# EasyEDA Pro project ProProject_2024电赛备赛清单_Wang01_2024-08-05.epro, schematic Schematic4
Create Date: 2024-07-20; Page Name: P1; Project Name: 2024电赛备赛清单_Wang01; Schematic Name: Schematic4; Update Date: 2024-07-20; Company: 嘉立创EDA; Page Size: A4; Version: V1.0
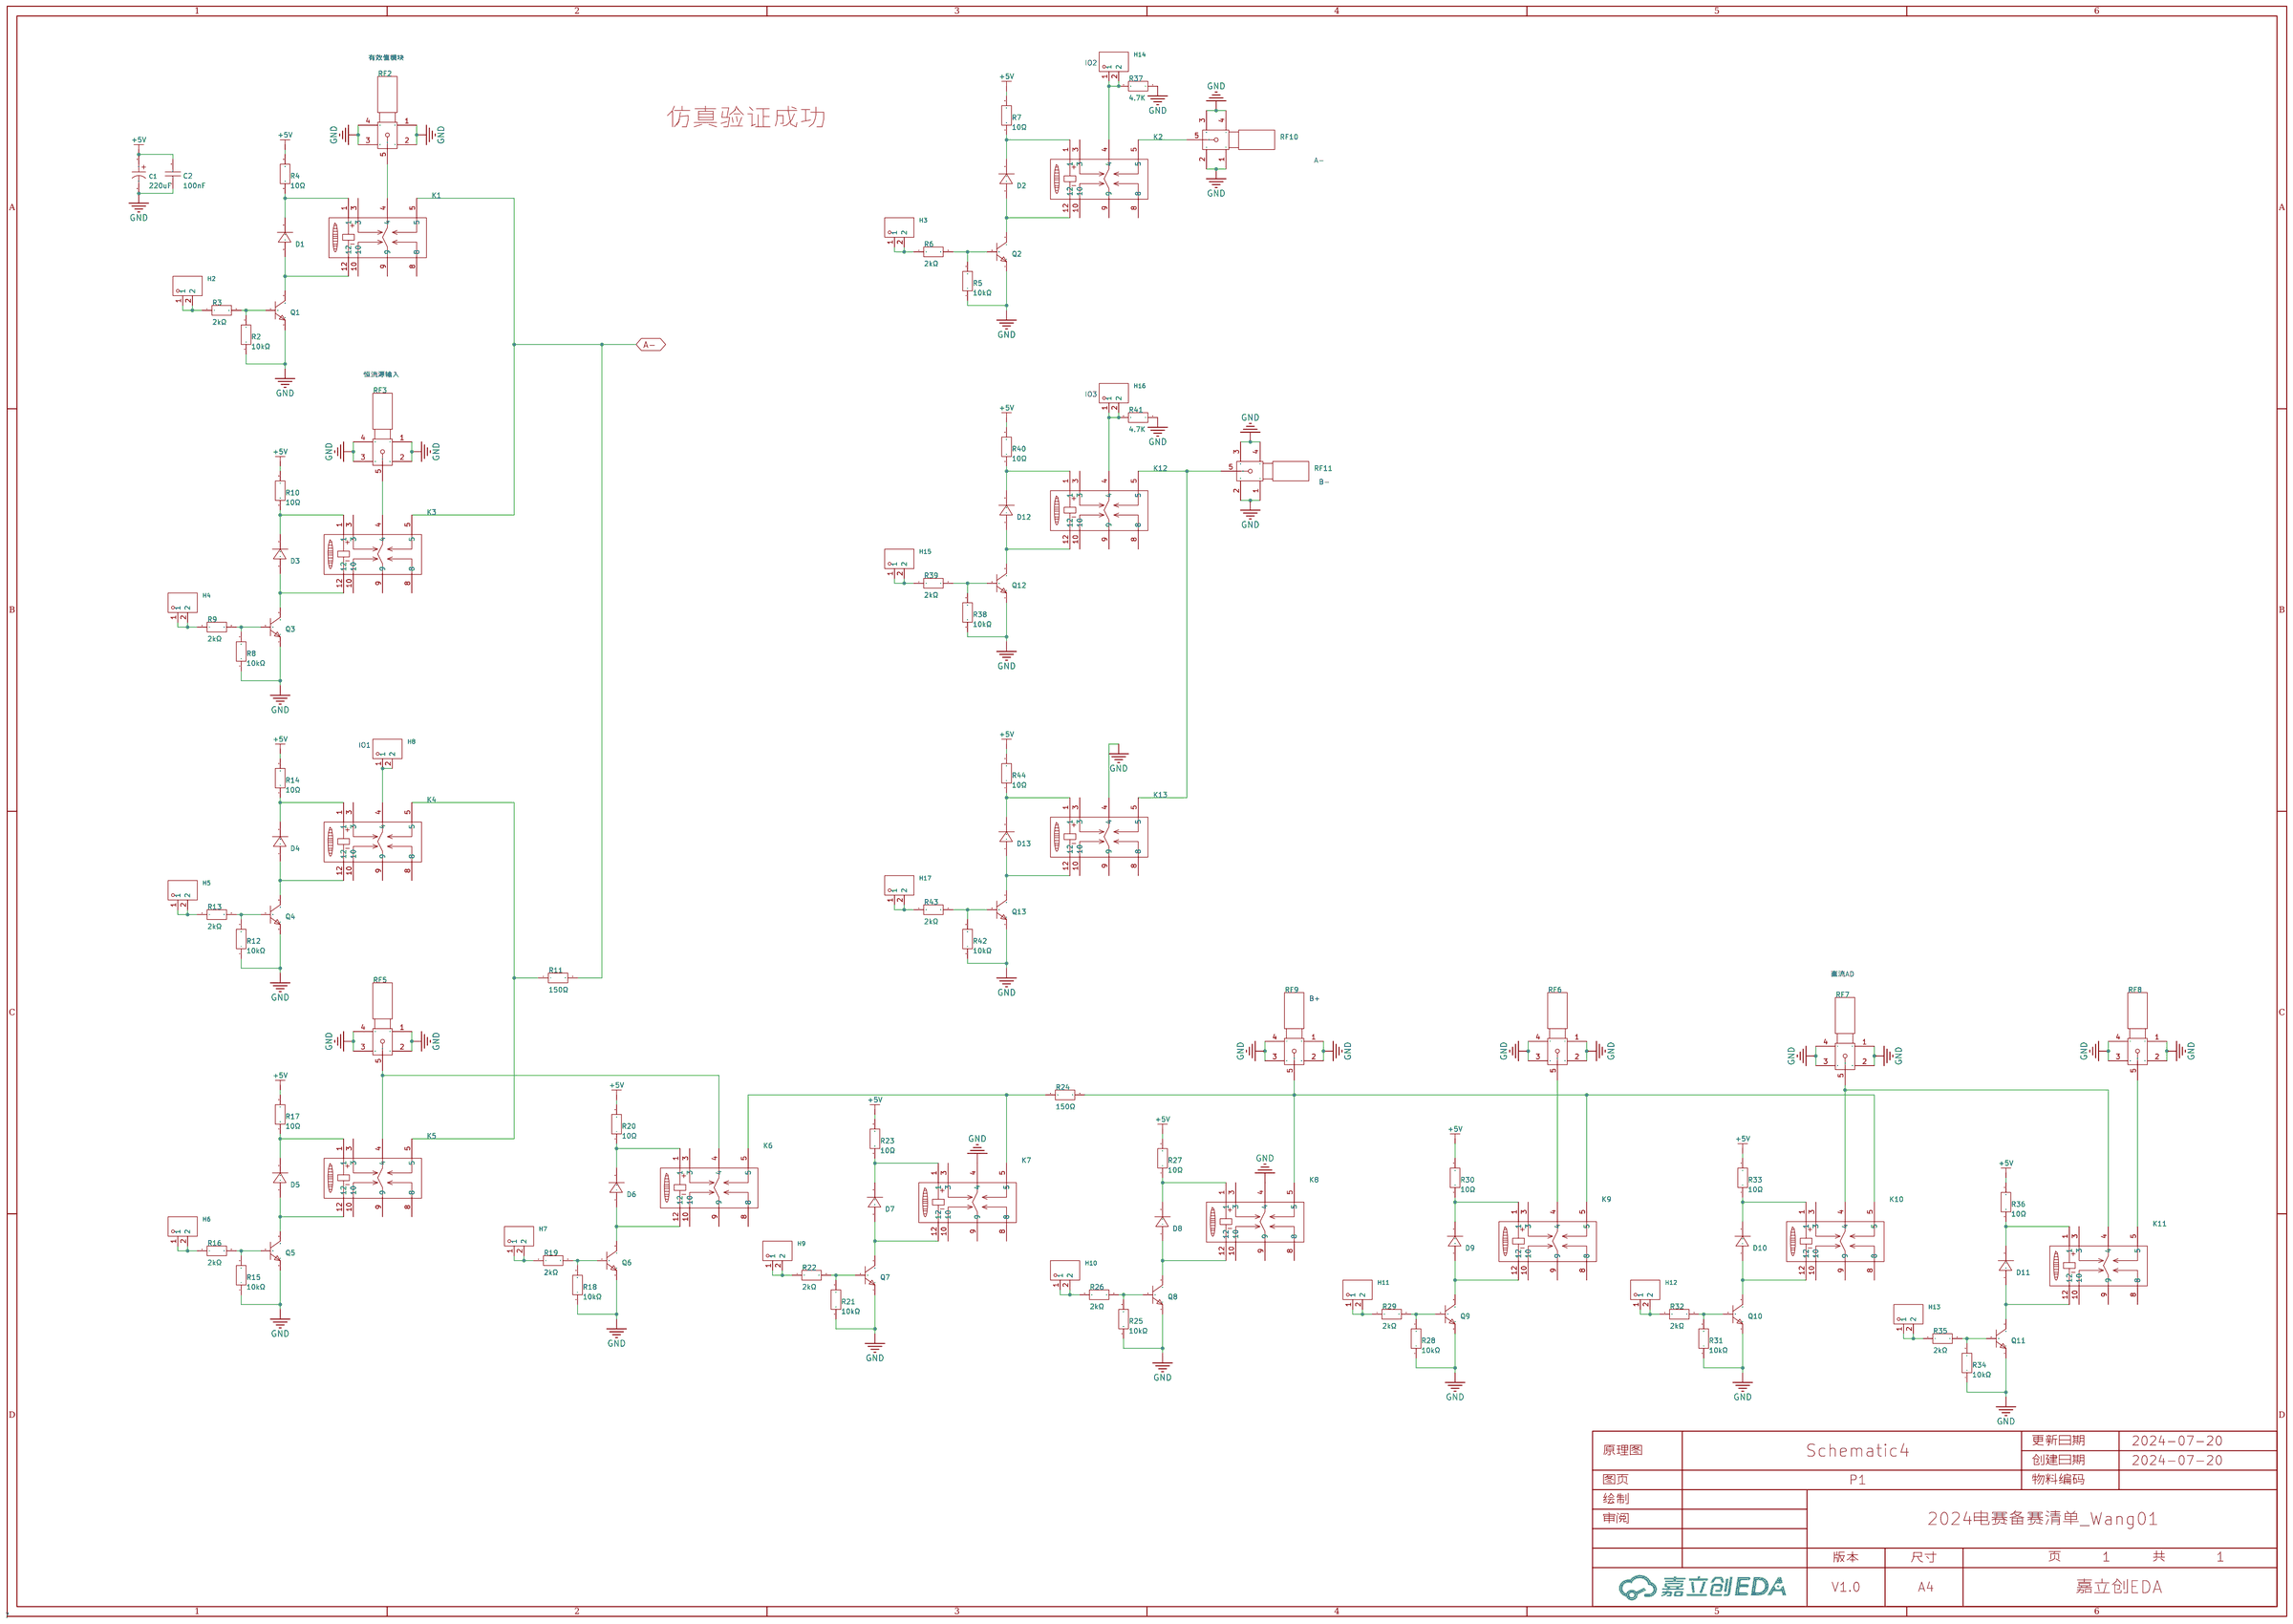
[diagram p3: schematic sheet]

## Parts
C1  220uF  [CAP-SMD_BD6.3-L6.6-W6.6-FD]
C2  100nF  [C0603]
D1  1N4148  [DO-35_BD2.0-L4.0-P8.00-D0.5-FD]
D2  1N4148  [DO-35_BD2.0-L4.0-P8.00-D0.5-FD]
D3  1N4148  [DO-35_BD2.0-L4.0-P8.00-D0.5-FD]
D4  1N4148  [DO-35_BD2.0-L4.0-P8.00-D0.5-FD]
D5  1N4148  [DO-35_BD2.0-L4.0-P8.00-D0.5-FD]
D6  1N4148  [DO-35_BD2.0-L4.0-P8.00-D0.5-FD]
D7  1N4148  [DO-35_BD2.0-L4.0-P8.00-D0.5-FD]
D8  1N4148  [DO-35_BD2.0-L4.0-P8.00-D0.5-FD]
D9  1N4148  [DO-35_BD2.0-L4.0-P8.00-D0.5-FD]
D10  1N4148  [DO-35_BD2.0-L4.0-P8.00-D0.5-FD]
D11  1N4148  [DO-35_BD2.0-L4.0-P8.00-D0.5-FD]
D12  1N4148  [DO-35_BD2.0-L4.0-P8.00-D0.5-FD]
D13  1N4148  [DO-35_BD2.0-L4.0-P8.00-D0.5-FD]
H2  PZ254V-11-02P  [HDR-TH_2P-P2.54-V-M]
H3  PZ254V-11-02P  [HDR-TH_2P-P2.54-V-M]
H4  PZ254V-11-02P  [HDR-TH_2P-P2.54-V-M]
H5  PZ254V-11-02P  [HDR-TH_2P-P2.54-V-M]
H6  PZ254V-11-02P  [HDR-TH_2P-P2.54-V-M]
H7  PZ254V-11-02P  [HDR-TH_2P-P2.54-V-M]
H8  PZ254V-11-02P  [HDR-TH_2P-P2.54-V-M]
H9  PZ254V-11-02P  [HDR-TH_2P-P2.54-V-M]
H10  PZ254V-11-02P  [HDR-TH_2P-P2.54-V-M]
H11  PZ254V-11-02P  [HDR-TH_2P-P2.54-V-M]
H12  PZ254V-11-02P  [HDR-TH_2P-P2.54-V-M]
H13  PZ254V-11-02P  [HDR-TH_2P-P2.54-V-M]
H14  PZ254V-11-02P  [HDR-TH_2P-P2.54-V-M]
H15  PZ254V-11-02P  [HDR-TH_2P-P2.54-V-M]
H16  PZ254V-11-02P  [HDR-TH_2P-P2.54-V-M]
H17  PZ254V-11-02P  [HDR-TH_2P-P2.54-V-M]
K1  G6S-2 DC5  [RELAY-TH_G6S-2-X]
K2  G6S-2 DC5  [RELAY-TH_G6S-2-X]
K3  G6S-2 DC5  [RELAY-TH_G6S-2-X]
K4  G6S-2 DC5  [RELAY-TH_G6S-2-X]
K5  G6S-2 DC5  [RELAY-TH_G6S-2-X]
K6  G6S-2 DC5  [RELAY-TH_G6S-2-X]
K7  G6S-2 DC5  [RELAY-TH_G6S-2-X]
K8  G6S-2 DC5  [RELAY-TH_G6S-2-X]
K9  G6S-2 DC5  [RELAY-TH_G6S-2-X]
K10  G6S-2 DC5  [RELAY-TH_G6S-2-X]
K11  G6S-2 DC5  [RELAY-TH_G6S-2-X]
K12  G6S-2 DC5  [RELAY-TH_G6S-2-X]
K13  G6S-2 DC5  [RELAY-TH_G6S-2-X]
Q1  SS8050  [TO-92-3_L4.9-W3.7-P1.27-L]
Q2  SS8050  [TO-92-3_L4.9-W3.7-P1.27-L]
Q3  SS8050  [TO-92-3_L4.9-W3.7-P1.27-L]
Q4  SS8050  [TO-92-3_L4.9-W3.7-P1.27-L]
Q5  SS8050  [TO-92-3_L4.9-W3.7-P1.27-L]
Q6  SS8050  [TO-92-3_L4.9-W3.7-P1.27-L]
Q7  SS8050  [TO-92-3_L4.9-W3.7-P1.27-L]
Q8  SS8050  [TO-92-3_L4.9-W3.7-P1.27-L]
Q9  SS8050  [TO-92-3_L4.9-W3.7-P1.27-L]
Q10  SS8050  [TO-92-3_L4.9-W3.7-P1.27-L]
Q11  SS8050  [TO-92-3_L4.9-W3.7-P1.27-L]
Q12  SS8050  [TO-92-3_L4.9-W3.7-P1.27-L]
Q13  SS8050  [TO-92-3_L4.9-W3.7-P1.27-L]
R2  10kΩ  [RES-TH_BD2.4-L6.3-P10.30-D0.6]
R3  2kΩ  [RES-TH_BD2.4-L6.3-P10.30-D0.6]
R4  10Ω  [RES-TH_BD2.4-L6.3-P10.30-D0.6]
R5  10kΩ  [RES-TH_BD2.4-L6.3-P10.30-D0.6]
R6  2kΩ  [RES-TH_BD2.4-L6.3-P10.30-D0.6]
R7  10Ω  [RES-TH_BD2.4-L6.3-P10.30-D0.6]
R8  10kΩ  [RES-TH_BD2.4-L6.3-P10.30-D0.6]
R9  2kΩ  [RES-TH_BD2.4-L6.3-P10.30-D0.6]
R10  10Ω  [RES-TH_BD2.4-L6.3-P10.30-D0.6]
R11  150Ω  [RES-TH_BD2.4-L6.3-P10.30-D0.6]
R12  10kΩ  [RES-TH_BD2.4-L6.3-P10.30-D0.6]
R13  2kΩ  [RES-TH_BD2.4-L6.3-P10.30-D0.6]
R14  10Ω  [RES-TH_BD2.4-L6.3-P10.30-D0.6]
R15  10kΩ  [RES-TH_BD2.4-L6.3-P10.30-D0.6]
R16  2kΩ  [RES-TH_BD2.4-L6.3-P10.30-D0.6]
R17  10Ω  [RES-TH_BD2.4-L6.3-P10.30-D0.6]
R18  10kΩ  [RES-TH_BD2.4-L6.3-P10.30-D0.6]
R19  2kΩ  [RES-TH_BD2.4-L6.3-P10.30-D0.6]
R20  10Ω  [RES-TH_BD2.4-L6.3-P10.30-D0.6]
R21  10kΩ  [RES-TH_BD2.4-L6.3-P10.30-D0.6]
R22  2kΩ  [RES-TH_BD2.4-L6.3-P10.30-D0.6]
R23  10Ω  [RES-TH_BD2.4-L6.3-P10.30-D0.6]
R24  150Ω  [RES-TH_BD2.4-L6.3-P10.30-D0.6]
R25  10kΩ  [RES-TH_BD2.4-L6.3-P10.30-D0.6]
R26  2kΩ  [RES-TH_BD2.4-L6.3-P10.30-D0.6]
R27  10Ω  [RES-TH_BD2.4-L6.3-P10.30-D0.6]
R28  10kΩ  [RES-TH_BD2.4-L6.3-P10.30-D0.6]
R29  2kΩ  [RES-TH_BD2.4-L6.3-P10.30-D0.6]
R30  10Ω  [RES-TH_BD2.4-L6.3-P10.30-D0.6]
R31  10kΩ  [RES-TH_BD2.4-L6.3-P10.30-D0.6]
R32  2kΩ  [RES-TH_BD2.4-L6.3-P10.30-D0.6]
R33  10Ω  [RES-TH_BD2.4-L6.3-P10.30-D0.6]
R34  10kΩ  [RES-TH_BD2.4-L6.3-P10.30-D0.6]
R35  2kΩ  [RES-TH_BD2.4-L6.3-P10.30-D0.6]
R36  10Ω  [RES-TH_BD2.4-L6.3-P10.30-D0.6]
R37  4.7K  [RES-TH_BD2.4-L6.3-P10.30-D0.6]
R38  10kΩ  [RES-TH_BD2.4-L6.3-P10.30-D0.6]
R39  2kΩ  [RES-TH_BD2.4-L6.3-P10.30-D0.6]
R40  10Ω  [RES-TH_BD2.4-L6.3-P10.30-D0.6]
R41  4.7K  [RES-TH_BD2.4-L6.3-P10.30-D0.6]
R42  10kΩ  [RES-TH_BD2.4-L6.3-P10.30-D0.6]
R43  2kΩ  [RES-TH_BD2.4-L6.3-P10.30-D0.6]
R44  10Ω  [RES-TH_BD2.4-L6.3-P10.30-D0.6]
RF2  BWSMA-KE-Z001  [SMA-TH_BWSMA-KE-Z001]
RF3  BWSMA-KE-Z001  [SMA-TH_BWSMA-KE-Z001]
RF5  BWSMA-KE-Z001  [SMA-TH_BWSMA-KE-Z001]
RF6  BWSMA-KE-Z001  [SMA-TH_BWSMA-KE-Z001]
RF7  BWSMA-KE-Z001  [SMA-TH_BWSMA-KE-Z001]
RF8  BWSMA-KE-Z001  [SMA-TH_BWSMA-KE-Z001]
RF9  BWSMA-KE-Z001  [SMA-TH_BWSMA-KE-Z001]
RF10  BWSMA-KE-Z001  [SMA-TH_BWSMA-KE-Z001]
RF11  BWSMA-KE-Z001  [SMA-TH_BWSMA-KE-Z001]

## Library data of the parts
C1 = RVT220UF16V67RV0015: 容值:220uF;精度:±20%;额定电压:16V;纹波电流:110mA@120Hz;等效串联电阻:-;; LCSC Part Name: 220uF ±20% 16V; Supplier Part: C2887273; Manufacturer: KNSCHA(科尼盛); Supplier Footprint: SMD,D6.3xL7.7mm; Datasheet: https://atta.szlcsc.com/upload/public/pdf/source/20210824/3DC9999D9B098FE241E3A26137981C4C.pdf; Supplier: LCSC; Tolerance: ±20%; Rated Voltage: 16V; φD: 6.3mm; L: 7.7mm; Ripple Current: 110mA@120Hz; Lifetime @ Temp: 2000hrs@105℃; Operating Temperature: -55℃~+105℃
C2 = 0603B104K500NT: 容值:100nF;精度:±10%;额定电压:50V;材质(温度系数):X7R;; LCSC Part Name: 100nF ±10% 50V; Supplier Part: C30926; Manufacturer: FH(风华); Supplier Footprint: 0603; Datasheet: https://atta.szlcsc.com/upload/public/pdf/source/20170923/C30926_1506149436298988724.pdf; Supplier: LCSC; Tolerance: ±10%; Voltage Rated: 50V; Temperature Coefficient: X7R
D1-D13 = 1N4148_C14516: 二极管配置:-;功率:500mW;直流反向耐压(Vr):75V;平均整流电流(Io):200mA;正向压降(Vf):1V@10mA;反向电流(Ir):5uA@75V;反向恢复时间(trr):4ns;工作温度:+200℃@(Tj);; LCSC Part Name: 75V 200mA 4ns; Supplier Part: C14516; Manufacturer: ST(先科); Supplier Footprint: DO-35; Datasheet: https://atta.szlcsc.com/upload/public/pdf/source/20140303/1457707004955.pdf; Supplier: LCSC; Power Dissipation: 500mW; Reverse Voltage (Vr): 75V; Average Rectified Current (Io): 200mA; Forward Voltage (Vf@If): 1V@10mA; Reverse Leakage Current: 5uA@75V; Reverse Recovery Time (trr): 4ns; Operating Temperature: +200℃@(Tj)
H2-H17 = PZ254V-11-02P: 排数:单排;总PIN位数:2P;间距:2.54mm;插针结构:1x2P;行距:-;安装类型:直插;圆针/方针:方针;额定电流:-;额定电压:-;配合针长度:6mm;塑高:2.5mm;端接针长度:3mm;触头材质:黄铜;触头镀层:-;工作温度范围:-40℃~+105℃;颜色:黑色;; LCSC Part Name: 2.54mm 1x2P 直插 方针; Supplier Part: C492401; Manufacturer: XFCN(兴飞); Supplier Footprint: 插件,P=2.54mm; Datasheet: https://atta.szlcsc.com/upload/public/pdf/source/20200309/C492401_A812433581A9B211A7FFA413ADDFF0E5.pdf; Supplier: LCSC; Number of Rows: 单排; Number of Pins: 2P; Pitch: 2.54mm; Pin Structure: 1x2P; Mounting Type: 直插; Circluar Pins/Square Pins: 方针; Length of Mating Pin: 6mm; Insulation Height: 2.5mm; Length of End Connection Pin: 3mm; Contact Material: 黄铜; Operating Temperature Range: -40℃~+105℃; Color: 黑色
K1-K13 = G6S-2 DC5: 线圈电压:-;触点形式:-;最大切换电压:-;最大切换电流:-;线圈类型:-;触点材料:-;; LCSC Part Name: G6S-2-5V; Supplier Part: C32776; Manufacturer: OMRON(欧姆龙); Supplier Footprint: DIP-8; JLCPCB Part Class: 扩展库; Datasheet: https://atta.szlcsc.com/upload/public/pdf/source/20180910/C231396_388937E7606AF1B60CB333B596E64AED.pdf; Supplier: LCSC
Q1-Q13 = SS8050_C12840: 晶体管类型:NPN;集射极击穿电压(Vceo):25V;集电极电流(Ic):1.5A;功率(Pd):1W;集电极截止电流(Icbo):100nA;集电极-发射极饱和电压(VCE(sat)@Ic,Ib):500mV@800mA,80mA;直流电流增益(hFE@Ic,Vce):200@100mA,1V;特征频率(fT):100MHz;工作温度:+150℃@(Tj);; LCSC Part Name: NPN 25V 1.5A D档 200-300; Supplier Part: C12840; Manufacturer: CJ(江苏长电/长晶); Supplier Footprint: TO-92(TO-92-3); Datasheet: https://atta.szlcsc.com/upload/public/pdf/source/20140809/1457707204665.pdf; Supplier: LCSC; Transistor Type: NPN; Collector-Emitter Breakdown Voltage (Vceo): 25V; Collector Current (Ic): 1.5A; Power Dissipation (Pd): 1W; Collector Cut-Off Current (Icbo): 100nA; Collector-Emitter Saturation Voltage (VCE(sat)@Ic,Ib): 500mV@800mA,80mA; DC Current Gain (hFE@Ic,Vce): 200@100mA,1V; Transition Frequency (fT): 100MHz; Operating Temperature: +150℃@(Tj)
R2-R44 = RN1/4W10KFT/BA1: 电阻类型:金属膜电阻;阻值:10kΩ;精度:±1%;功率:250mW;温度系数:±50ppm/℃;最大工作电压:250V;工作温度范围:-55℃~+125℃;; LCSC Part Name: 金属膜电阻 10kΩ ±1% 250mW; Supplier Part: C410695; Manufacturer: Tyohm(幸亚电阻); Supplier Footprint: 插件; Datasheet: https://atta.szlcsc.com/upload/public/pdf/source/20190808/C410695_F4C96186075092C4BC649A77CE7E5B2A.pdf; Supplier: LCSC; Type: 金属膜电阻; Tolerance: ±1%; Power(Watts): 250mW; Temperature Coefficient: ±50ppm/℃; Overload Voltage (Max): 250V; Operating Temperature Range: -55℃~+125℃
RF2 RF3 RF5-RF11 = BWSMA-KE-Z001_C496549: 连接器类型:板端;射频系列:SMA;接口类型:内孔;端口数量:1;阻抗:50Ω;频率-最大值:12.4GHz;样式:正脚;接口直径:-;接口长度/高度:-;工作温度范围:-65℃~+165℃;; LCSC Part Name: SMA 内孔 正脚 SMA直头正脚板端座子; Supplier Part: C496549; Manufacturer: BAT WIRELESS(蝙蝠无线); Supplier Footprint: 插件; Datasheet: https://atta.szlcsc.com/upload/public/pdf/source/20200416/C496549_767995352B6C9E98F20D658FDC70347F.pdf; Supplier: LCSC; Connector Type: 板端; RF Series: SMA; Interface Type: 内孔; Number of Ports: 1; Impedance: 50Ω; Frequency-Max: 12.4GHz; Style: 正脚; Operating Temperature Range: -65℃~+165℃

## Nets
+5V: C1.1 C2.2 R4.2 R7.2 R10.2 R14.2 R17.2 R20.2 R23.2 R27.2 R30.2 R33.2 R36.2 R40.2 R44.2
GND: C1.2 C2.1 K7.4 K8.4 K13.4 Q1.1(E) Q2.1(E) Q3.1(E) Q4.1(E) Q5.1(E) Q6.1(E) Q7.1(E) Q8.1(E) Q9.1(E) Q10.1(E) Q11.1(E) Q12.1(E) Q13.1(E) R2.1 R5.1 R8.1 R12.1 R15.1 R18.1 R21.1 R25.1 R28.1 R31.1 R34.1 R37.1 R38.1 R41.1 R42.1 RF2.1 RF2.2 RF2.3 RF2.4 RF3.1 RF3.2 RF3.3 RF3.4 RF5.1 RF5.2 RF5.3 RF5.4 RF6.1 RF6.2 RF6.3 RF6.4 RF7.1 RF7.2 RF7.3 RF7.4 RF8.1 RF8.2 RF8.3 RF8.4 RF9.1 RF9.2 RF9.3 RF9.4 RF10.1 RF10.2 RF10.3 RF10.4 RF11.1 RF11.2 RF11.3 RF11.4
A-: K1.5 K3.5 R11.2
$1N747: Q1.2(B) R2.2 R3.2
$1N976: D1.2(C) K1.1 R4.1
$1N980: D1.1(A) K1.12 Q1.3(C)
$1N1135: H2.1 H2.2 R3.1
$1N1475: Q2.2(B) R5.2 R6.2
$1N1479: D2.2(C) K2.1 R7.1
$1N1483: D2.1(A) K2.12 Q2.3(C)
$1N1489: H3.1 H3.2 R6.1
$1N1579: K1.4 RF2.5
$1N2713: Q3.2(B) R8.2 R9.2
$1N2714: D3.2(C) K3.1 R10.1
$1N2715: D3.1(A) K3.12 Q3.3(C)
$1N2717: H4.1 H4.2 R9.1
$1N2720: K3.4 RF3.5
$1N3255: Q4.2(B) R12.2 R13.2
$1N3256: D4.2(C) K4.1 R14.1
$1N3257: D4.1(A) K4.12 Q4.3(C)
$1N3259: H5.1 H5.2 R13.1
$1N3674: Q5.2(B) R15.2 R16.2
$1N3675: D5.2(C) K5.1 R17.1
$1N3676: D5.1(A) K5.12 Q5.3(C)
$1N3678: H6.1 H6.2 R16.1
$1N3701: K4.5 K5.5 R11.1
$1N5477: Q6.2(B) R18.2 R19.2
$1N5478: D6.2(C) K6.1 R20.1
$1N5479: D6.1(A) K6.12 Q6.3(C)
$1N5481: H7.1 H7.2 R19.1
$1N5539: H8.1 H8.2 K4.4
$1N5543: K5.4 K6.4 RF5.5
$1N5923: Q7.2(B) R21.2 R22.2
$1N5924: D7.2(C) K7.1 R23.1
$1N5925: D7.1(A) K7.12 Q7.3(C)
$1N5934: K6.5 K7.5 R24.1
$1N6337: Q8.2(B) R25.2 R26.2
$1N6338: D8.2(C) K8.1 R27.1
$1N6339: D8.1(A) K8.12 Q8.3(C)
$1N6689: Q9.2(B) R28.2 R29.2
$1N6690: D9.2(C) K9.1 R30.1
$1N6691: D9.1(A) K9.12 Q9.3(C)
$1N6816: K9.4 RF6.5
$1N7211: Q10.2(B) R31.2 R32.2
$1N7212: D10.2(C) K10.1 R33.1
$1N7213: D10.1(A) K10.12 Q10.3(C)
$1N7776: Q11.2(B) R34.2 R35.2
$1N7777: D11.2(C) K11.1 R36.1
$1N7778: D11.1(A) K11.12 Q11.3(C)
$1N7800: K10.4 K11.4 RF7.5
$1N7895: K11.5 RF8.5
$1N8147: K8.5 K9.5 K10.5 R24.2 RF9.5
$1N8286: H14.1 H14.2 K2.4 R37.2
$1N8433: K2.5 RF10.5
$1N8924: Q12.2(B) R38.2 R39.2
$1N8925: D12.2(C) K12.1 R40.1
$1N8926: D12.1(A) K12.12 Q12.3(C)
$1N8928: H15.1 H15.2 R39.1
$1N8929: H16.1 H16.2 K12.4 R41.2
$1N9945: Q13.2(B) R42.2 R43.2
$1N9946: D13.2(C) K13.1 R44.1
$1N9947: D13.1(A) K13.12 Q13.3(C)
$1N9949: H17.1 H17.2 R43.1
$1N9969: K12.5 K13.5 RF11.5
$1N13542: H9.1 H9.2 R22.1
$1N13548: H10.1 H10.2 R26.1
$1N13561: H11.1 H11.2 R29.1
$1N13567: H12.1 H12.2 R32.1
$1N13573: H13.1 H13.2 R35.1

Not connected (* = marked no-connect by the designer): K1 3 8 9 10; K2 3 8 9 10; K3 3 8 9 10; K4 3 8 9 10; K5 3 8 9 10; K6 3 8 9 10; K7 3 8 9 10; K8 3 8 9 10; K9 3 8 9 10; K10 3 8 9 10; K11 3 8 9 10; K12 3 8 9 10; K13 3 8 9 10

## Notes on the sheet
- 有效值模块
- IO2
- 仿真验证成功
- A-
- 恒流源输入
- IO3
- B-
- IO1
- 直流AD
- B+
